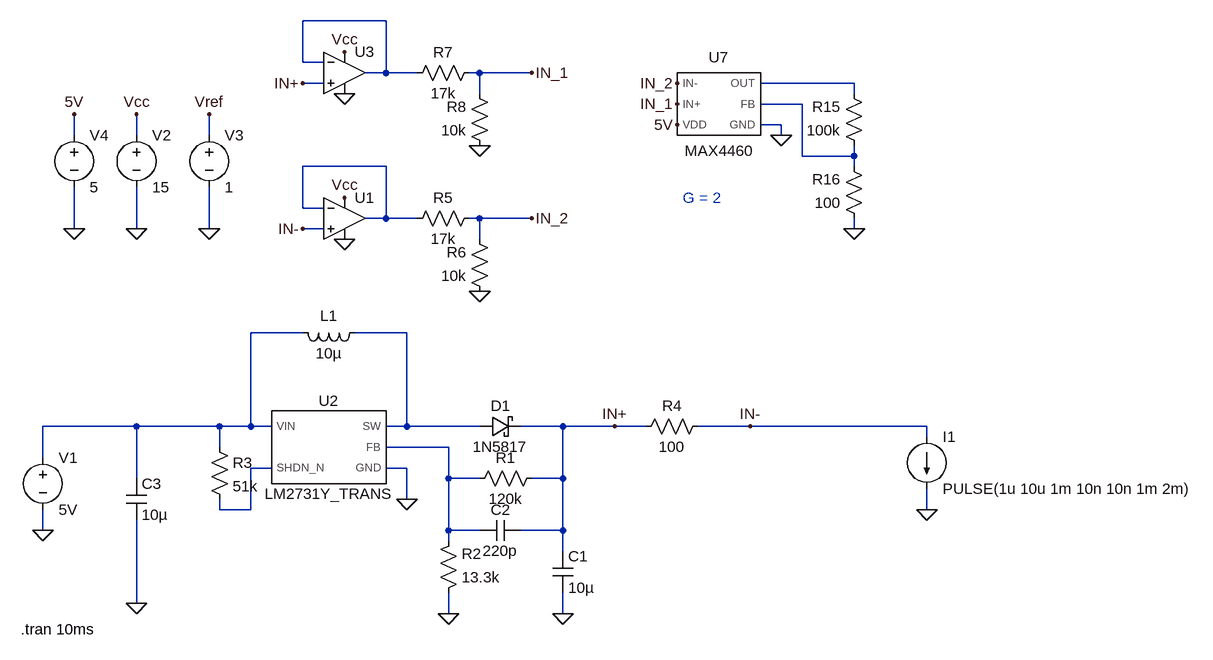
[diagram p0: schematic main.asc]
main.asc, the LTspice schematic file:
Version 4
SHEET 1 1732 680
WIRE -96 -624 -224 -624
WIRE -224 -560 -224 -624
WIRE -192 -560 -224 -560
WIRE -96 -544 -96 -624
WIRE -96 -544 -128 -544
WIRE -48 -544 -96 -544
WIRE 48 -544 32 -544
WIRE 128 -544 48 -544
WIRE -192 -528 -224 -528
WIRE 624 -528 480 -528
WIRE 48 -512 48 -544
WIRE 624 -512 624 -528
WIRE 544 -496 480 -496
WIRE 512 -464 480 -464
WIRE -576 -448 -576 -480
WIRE -480 -448 -480 -480
WIRE -368 -448 -368 -480
WIRE 512 -448 512 -464
WIRE 544 -416 544 -496
WIRE 624 -416 624 -432
WIRE 624 -416 544 -416
WIRE -96 -400 -224 -400
WIRE 624 -400 624 -416
WIRE -224 -336 -224 -400
WIRE -192 -336 -224 -336
WIRE -96 -320 -96 -400
WIRE -96 -320 -128 -320
WIRE -48 -320 -96 -320
WIRE 48 -320 32 -320
WIRE 128 -320 48 -320
WIRE -576 -304 -576 -368
WIRE -480 -304 -480 -368
WIRE -368 -304 -368 -368
WIRE -192 -304 -224 -304
WIRE 624 -304 624 -320
WIRE 48 -288 48 -320
WIRE -224 -144 -304 -144
WIRE -64 -144 -144 -144
WIRE -480 0 -624 0
WIRE -352 0 -480 0
WIRE -304 0 -304 -144
WIRE -304 0 -352 0
WIRE -272 0 -304 0
WIRE -64 0 -64 -144
WIRE -64 0 -96 0
WIRE 48 0 -64 0
WIRE 176 0 112 0
WIRE 256 0 176 0
WIRE 304 0 256 0
WIRE 464 0 384 0
WIRE 736 0 464 0
WIRE 736 16 736 0
WIRE -352 32 -352 0
WIRE 0 32 -96 32
WIRE -624 48 -624 0
WIRE -272 64 -304 64
WIRE -64 64 -96 64
WIRE -480 80 -480 0
WIRE 0 80 0 32
WIRE 48 80 0 80
WIRE 176 80 176 0
WIRE 176 80 128 80
WIRE -64 112 -64 64
WIRE -352 128 -352 112
WIRE -304 128 -304 64
WIRE -304 128 -352 128
WIRE 736 128 736 96
WIRE -624 160 -624 128
WIRE 0 160 0 80
WIRE 48 160 0 160
WIRE 176 160 176 80
WIRE 176 160 112 160
WIRE 0 176 0 160
WIRE 176 192 176 160
WIRE -480 272 -480 144
WIRE 0 288 0 256
WIRE 176 288 176 256
FLAG 0 288 0
FLAG 176 288 0
FLAG -480 272 0
FLAG -64 112 0
FLAG -624 160 0
FLAG 736 128 0
FLAG -160 -288 0
FLAG -160 -352 Vcc
FLAG -160 -576 Vcc
FLAG -224 -528 IN+
FLAG -224 -304 IN-
FLAG 128 -544 IN_1
FLAG 128 -320 IN_2
FLAG -160 -512 0
FLAG 48 -432 0
FLAG 48 -208 0
FLAG 352 -496 IN_1
FLAG 352 -528 IN_2
FLAG 352 -464 5V
FLAG 512 -448 0
FLAG 624 -304 0
FLAG 256 0 IN+
FLAG 464 0 IN-
FLAG -480 -304 0
FLAG -368 -304 0
FLAG -368 -480 Vref
FLAG -480 -480 Vcc
FLAG -576 -304 0
FLAG -576 -480 5V
SYMBOL ind -128 -160 R90
WINDOW 0 5 56 VBottom 2
WINDOW 3 32 56 VTop 2
SYMATTR InstName L1
SYMATTR Value 10µ
SYMBOL schottky 48 16 R270
WINDOW 0 32 32 VTop 2
WINDOW 3 0 32 VBottom 2
SYMATTR InstName D1
SYMATTR Value 1N5817
SYMATTR Description Diode
SYMATTR Type diode
SYMBOL cap 160 192 R0
SYMATTR InstName C1
SYMATTR Value 10µ
SYMBOL res 144 64 R90
WINDOW 0 0 56 VBottom 2
WINDOW 3 32 56 VTop 2
SYMATTR InstName R1
SYMATTR Value 120k
SYMBOL res -16 272 M180
WINDOW 0 36 76 Left 2
WINDOW 3 36 40 Left 2
SYMATTR InstName R2
SYMATTR Value 13.3k
SYMBOL cap 112 144 R90
WINDOW 0 0 32 VBottom 2
WINDOW 3 32 32 VTop 2
SYMATTR InstName C2
SYMATTR Value 220p
SYMBOL cap -496 80 R0
SYMATTR InstName C3
SYMATTR Value 10µ
SYMBOL voltage -624 32 R0
WINDOW 123 0 0 Left 0
WINDOW 39 0 0 Left 0
SYMATTR InstName V1
SYMATTR Value 5V
SYMBOL res -368 16 R0
SYMATTR InstName R3
SYMATTR Value 51k
SYMBOL current 736 16 R0
WINDOW 123 0 0 Left 0
WINDOW 39 0 0 Left 0
SYMATTR InstName I1
SYMATTR Value PULSE(1u 10u 1m 10n 10n 1m 2m)
SYMBOL LM2731Y_TRANS -192 32 R0
SYMATTR InstName U2
SYMBOL res 400 -16 R90
WINDOW 0 0 56 VBottom 2
WINDOW 3 32 56 VTop 2
SYMATTR InstName R4
SYMATTR Value 100
SYMBOL res 48 -336 R90
WINDOW 0 0 56 VBottom 2
WINDOW 3 32 56 VTop 2
SYMATTR InstName R5
SYMATTR Value 17k
SYMBOL res 64 -192 R180
WINDOW 0 36 76 Left 2
WINDOW 3 36 40 Left 2
SYMATTR InstName R6
SYMATTR Value 10k
SYMBOL OpAmps\\UniversalOpamp -160 -320 R0
SYMATTR InstName U1
SYMBOL res 48 -560 R90
WINDOW 0 0 56 VBottom 2
WINDOW 3 32 56 VTop 2
SYMATTR InstName R7
SYMATTR Value 17k
SYMBOL res 64 -416 R180
WINDOW 0 36 76 Left 2
WINDOW 3 36 40 Left 2
SYMATTR InstName R8
SYMATTR Value 10k
SYMBOL OpAmps\\UniversalOpamp -160 -544 R0
SYMATTR InstName U3
SYMBOL res 640 -416 R180
WINDOW 0 36 76 Left 2
WINDOW 3 36 40 Left 2
SYMATTR InstName R15
SYMATTR Value 100k
SYMBOL res 640 -304 R180
WINDOW 0 36 76 Left 2
WINDOW 3 36 40 Left 2
SYMATTR InstName R16
SYMATTR Value 100
SYMBOL MAX4460 416 -496 R0
SYMATTR InstName U7
SYMBOL voltage -480 -464 R0
WINDOW 123 0 0 Left 0
WINDOW 39 0 0 Left 0
SYMATTR InstName V2
SYMATTR Value 15
SYMBOL voltage -368 -464 R0
WINDOW 123 0 0 Left 0
WINDOW 39 0 0 Left 0
SYMATTR InstName V3
SYMATTR Value 1
SYMBOL voltage -576 -464 R0
WINDOW 123 0 0 Left 0
WINDOW 39 0 0 Left 0
SYMATTR InstName V4
SYMATTR Value 5
TEXT -658 312 Left 2 !.tran 10ms
TEXT 360 -352 Left 2 ;G = 2

The netlist it stands for:
* main.asc
L1 N006 N005 10µ
D1 N006 IN+ 1N5817
C1 IN+ 0 10µ
R1 IN+ N007 120k
R2 0 N007 13.3k
C2 IN+ N007 220p
C3 N005 0 10µ
V1 N005 0 5V
R3 N005 N008 51k
I1 IN- 0 PULSE(1u 10u 1m 10n 10n 1m 2m)
XU2 N005 N008 N006 N007 0 LM2731Y_TRANS  ; pins VIN SHDN_N SW FB GND
R4 IN- IN+ 100
R5 IN_2 N004 17k
R6 0 IN_2 10k
XU1 IN- N004 Vcc 0 N004 level1 Avol=1Meg GBW=10Meg Vos=0 En=0 Enk=0 In=0 Ink=0 Rin=500Meg  ; pins In+ In- V+ V- OUT
R7 IN_1 N001 17k
R8 0 IN_1 10k
XU3 IN+ N001 Vcc 0 N001 level1 Avol=1Meg GBW=10Meg Vos=0 En=0 Enk=0 In=0 Ink=0 Rin=500Meg  ; pins In+ In- V+ V- OUT
R15 N003 N002 100k
R16 0 N003 100
XU7 N002 0 IN_1 IN_2 5V N003 MAX4460  ; pins OUT GND IN+ IN- VDD FB
V2 Vcc 0 15
V3 Vref 0 1
V4 5V 0 5
.model D D
.lib standard.dio
.tran 10ms
* G = 2
.lib D:\Users\javi_\GitHub\Microwatt_Board\Simu_Microwatt_Board\LM2731Y_TRANS.LIB
.lib UniversalOpAmp1.lib
.lib D:\Users\javi_\GitHub\Microwatt_Board\Simu_Microwatt_Board\MAX4460.lib
.backanno
.end